# EasyEDA Pro project G3107.eprj

# Schematic Schematic1
Board Name: Board1; Create Date: 2025-10-31; Page Name: P1; Project Name: G3107; Schematic Name: Schematic1; Update Date: 2025-10-31; Company: 嘉立创EDA; Page Size: A4; Version: V1.0
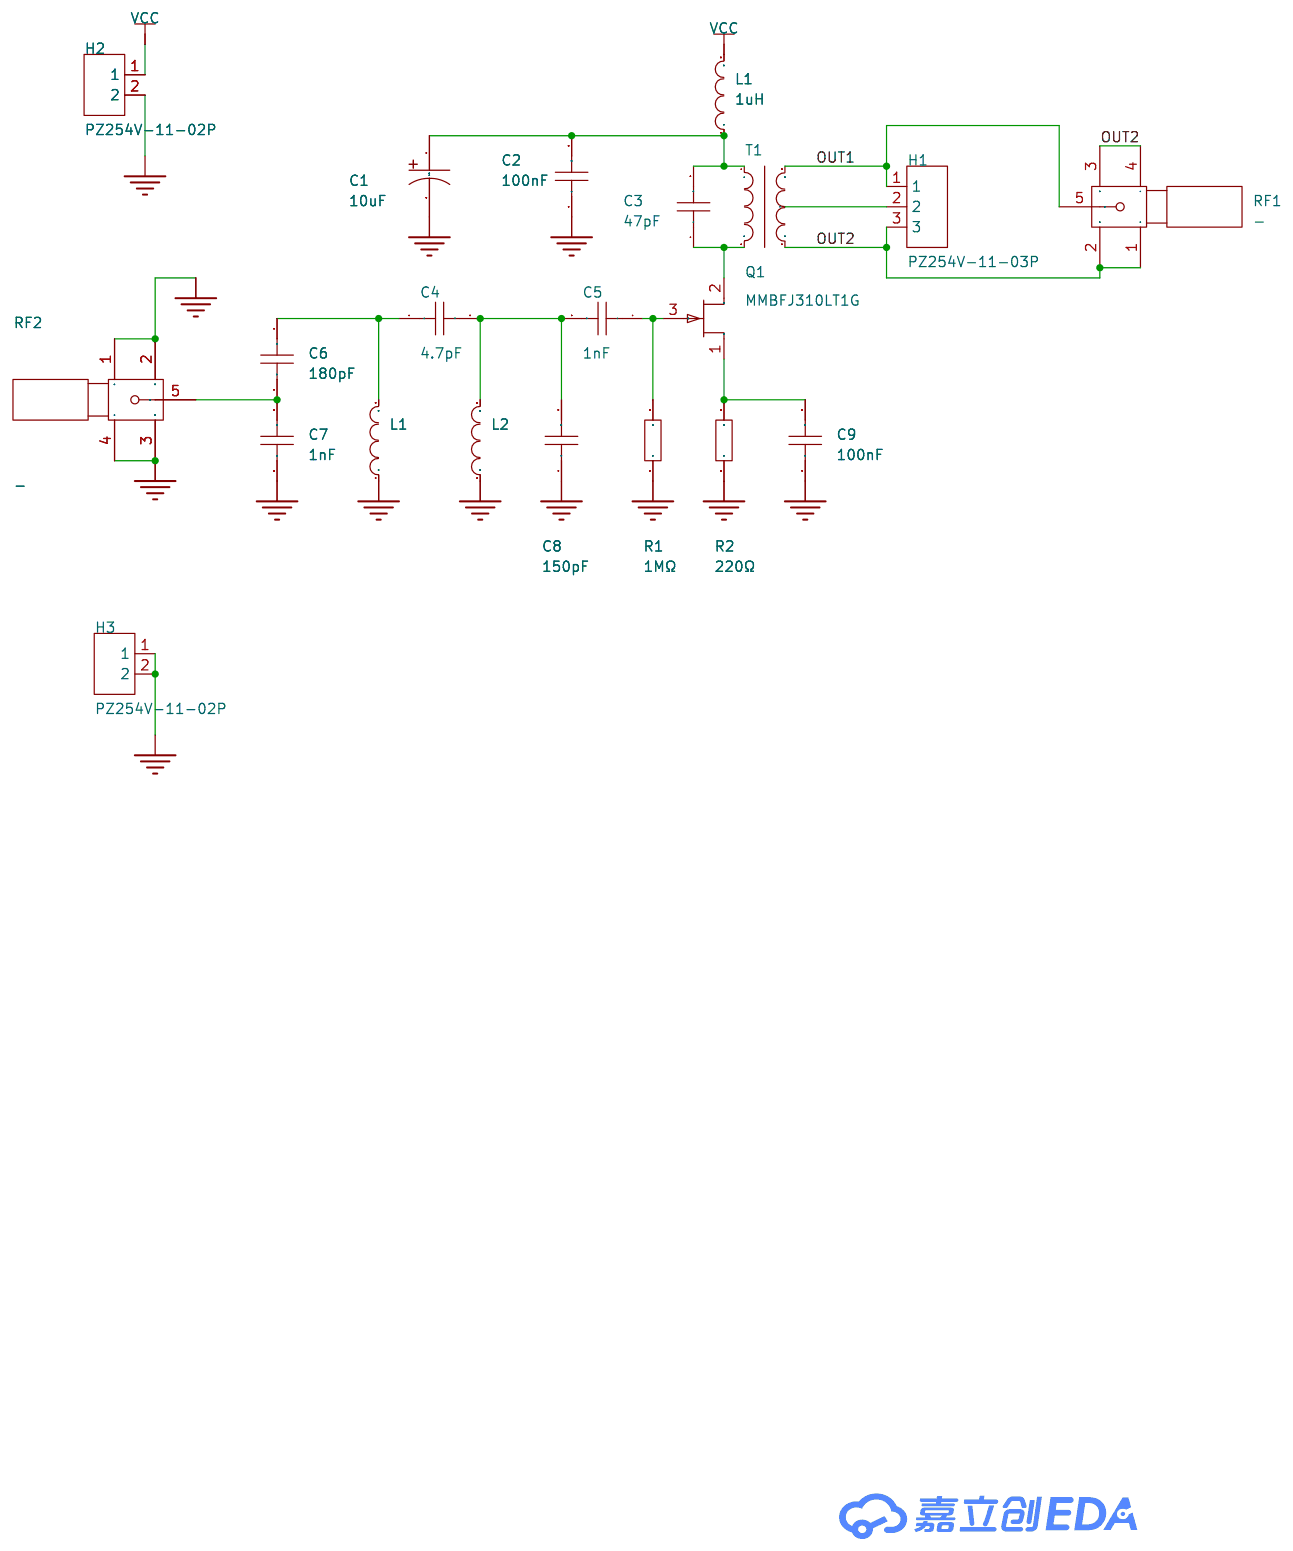
[diagram p0: schematic sheet]

## Parts
C1  10uF  [CAP-SMD_L3.2-W1.6]
C2  100nF  [C0603]
C3  47pF  [C0603]
C4  4.7pF  [C0603]
C5  1nF  [C0603]
C6  180pF  [C0603]
C7  1nF  [C0603]
C8  150pF  [C0603]
C9  100nF  [C0603]
H1  PZ254V-11-03P  [HDR-TH_3P-P2.54-V-M]
H2  PZ254V-11-02P  [HDR-TH_2P-P2.54-V-M]
H3  PZ254V-11-02P  [HDR-TH_2P-P2.54-V-M]
L1  1uH  [IND-SMD_L2.5-W2.0-A]
L1#2  -  [LoT37]
L2  -  [LoT37]
Q1  MMBFJ310LT1G  [SOT-23-3_L2.9-W1.6-P1.90-LS2.8-BR]
R1  1MΩ  [R0603]
R2  220Ω  [R0603]
RF1  -  [SMA-TH_BWSMA-KWE-Z001]
RF2  -  [SMA-TH_BWSMA-KWE-Z001]
T1  -  [ToT37]

## Library data of the parts
C1 = TMCMA0J106MTRF: LCSC Part Name: 10uF ±20% 6.3V; Supplier Part: C215893; Manufacturer: VISHAY(威世); Supplier Footprint: CASE-A-3216; JLCPCB Part Class: 扩展库; Datasheet: https://item.szlcsc.com/datasheet/TMCMA0J106MTRF/216705.html; Supplier: LCSC; Tolerance: ±20%; Voltage Rating: 6.3V; Equivalent Series Resistance(ESR): 2.9Ω@100kHz; Operating Temperature: -55℃~+125℃
C2 C9 = CC0603KRX7R9BB104: LCSC Part Name: 100nF ±10% 50V; Supplier Part: C14663; Manufacturer: YAGEO(国巨); Supplier Footprint: 0603; JLCPCB Part Class: 基础库; Datasheet: https://item.szlcsc.com/datasheet/CC0603KRX7R9BB104/15331.html; Supplier: LCSC; Tolerance: ±10%; Voltage Rating: 50V; Temperature Coefficient: X7R
C3 = CC0603FRNPO9BN470: LCSC Part Name: 47pF ±1% 50V; Supplier Part: C519486; Manufacturer: YAGEO(国巨); Supplier Footprint: 0603; JLCPCB Part Class: 扩展库; Datasheet: https://item.szlcsc.com/datasheet/CC0603FRNPO9BN470/536157.html; Supplier: LCSC; Tolerance: ±1%; Voltage Rating: 50V; Temperature Coefficient: NP0
C4 = CC0603BRNPO9BN4R7: LCSC Part Name: ±0.1pF 4.7pF 50V; Supplier Part: C327022; Manufacturer: YAGEO(国巨); Supplier Footprint: 0603; JLCPCB Part Class: Extended Part; Datasheet: https://item.szlcsc.com/datasheet/CC0603BRNPO9BN4R7/307116.html; Supplier: LCSC; Voltage Rating: 50V; Temperature Coefficient: NP0
C5 C7 = CC0603FRNPO9BN102: LCSC Part Name: 1nF ±1% 50V; Supplier Part: C309468; Manufacturer: YAGEO(国巨); Supplier Footprint: 0603; JLCPCB Part Class: Extended Part; Datasheet: https://item.szlcsc.com/datasheet/CC0603FRNPO9BN102/293084.html; Supplier: LCSC; Tolerance: ±1%; Voltage Rating: 50V; Temperature Coefficient: NP0
C6 = CC0603FRNPO9BN181: LCSC Part Name: 180pF ±1% 50V; Supplier Part: C527047; Manufacturer: YAGEO(国巨); Supplier Footprint: 0603; JLCPCB Part Class: Extended Part; Datasheet: https://item.szlcsc.com/datasheet/CC0603FRNPO9BN181/545473.html; Supplier: LCSC; Tolerance: ±1%; Voltage Rating: 50V; Temperature Coefficient: NP0
C8 = CC0603FRNPO9BN151: LCSC Part Name: 150pF ±1% 50V; Supplier Part: C519499; Manufacturer: YAGEO(国巨); Supplier Footprint: 0603; JLCPCB Part Class: Extended Part; Datasheet: https://item.szlcsc.com/datasheet/CC0603FRNPO9BN151/536170.html; Supplier: LCSC; Tolerance: ±1%; Voltage Rating: 50V; Temperature Coefficient: NP0
H1 = PZ254V-11-03P: LCSC Part Name: 1x3P 间距:2.54mm 方针 直插; Supplier Part: C2937625; Manufacturer: XFCN(兴飞); Supplier Footprint: 插件,P=2.54mm; JLCPCB Part Class: 扩展库; Datasheet: https://item.szlcsc.com/datasheet/PZ254V-11-03P/3293280.html; Supplier: LCSC; Pin Structure: 1x3P; Pitch: 2.54mm; Circluar Pins/Square Pins: 方针; Mounting Type: 直插; Number of Rows: 单排; Number of Pins: 3P; Current Rating: 3A; Voltage Rating (Max): 250V; Length of Mating Pin: 6mm; Insulation Height: 2.5mm; Length of End Connection Pin: 3mm; Operating Temperature: -40℃~+105℃; Color: 黑色
H2 H3 = PZ254V-11-02P: LCSC Part Name: 1x2P 间距:2.54mm 方针 直插; Supplier Part: C492401; Manufacturer: XFCN(兴飞); Supplier Footprint: 插件,P=2.54mm; JLCPCB Part Class: 扩展库; Datasheet: https://item.szlcsc.com/datasheet/PZ254V-11-02P/502957.html; Supplier: LCSC; Pin Structure: 1x2P; Pitch: 2.54mm; Circluar Pins/Square Pins: 方针; Mounting Type: 直插; Number of Rows: 单排; Number of Pins: 2P; Length of Mating Pin: 6mm; Insulation Height: 2.5mm; Length of End Connection Pin: 3mm; Contact Material: 黄铜; Operating Temperature: -40℃~+105℃; Color: 黑色
L1 = MHCD252012A-1R0M-A8SDG: LCSC Part Name: 1uH ±20%; Supplier Part: C2991848; Manufacturer: chilisin(奇力新); Supplier Footprint: 1008; JLCPCB Part Class: 扩展库; Supplier: LCSC; Tolerance: ±20%; Type: 绕线片式电感
L1#2 L2 = LoT37
Q1 = MMBFJ310LT1G: Supplier Part: C33416; Manufacturer: onsemi(安森美); Supplier Footprint: SOT-23; JLCPCB Part Class: 扩展库; Datasheet: https://item.szlcsc.com/datasheet/MMBFJ310LT1G/34381.html; Supplier: LCSC
R1 = 0603WAF1004T5E: LCSC Part Name: 1MΩ ±1% 100mW 厚膜电阻; Supplier Part: C22935; Manufacturer: UNI-ROYAL(厚声); Supplier Footprint: 0603; JLCPCB Part Class: 基础库; Datasheet: https://atta.szlcsc.com/upload/public/pdf/source/20200306/C422600_1E6D84923E4A46A82E41ADD87F860B5C.pdf; Supplier: LCSC; Type: 厚膜电阻; Tolerance: ±1%; Power(Watts): 100mW; Overload Voltage (Max): 75V; Temperature Coefficient: ±100ppm/℃; Operating Temperature Range: -55℃~+155℃
R2 = 0603WAF2200T5E: LCSC Part Name: 220Ω ±1% 100mW 厚膜电阻; Supplier Part: C22962; Manufacturer: UNI-ROYAL(厚声); Supplier Footprint: 0603; JLCPCB Part Class: 基础库; Datasheet: https://atta.szlcsc.com/upload/public/pdf/source/20200306/C422600_1E6D84923E4A46A82E41ADD87F860B5C.pdf; Supplier: LCSC; Type: 厚膜电阻; Tolerance: ±1%; Power(Watts): 100mW; Overload Voltage (Max): 75V; Temperature Coefficient: ±100ppm/℃; Operating Temperature Range: -55℃~+155℃
RF1 RF2 = BWSMA-KWE-Z001: LCSC Part Name: 内孔 SMA 弯头; Supplier Part: C496551; Manufacturer: BAT WIRELESS(蝙蝠无线); Supplier Footprint: 插件; JLCPCB Part Class: 扩展库; Datasheet: https://item.szlcsc.com/datasheet/BWSMA-KWE-Z001/508500.html; Supplier: LCSC; Connector Type: 板端; Interface: 内孔; Number of Ports: 1; Interface Diameter: 5.3mm; RF Series: SMA; Impedance: 50Ω; Style: 弯头
T1 = ToT37

## Nets
GND: C1.2 C2.1 C7.1 C8.1 C9.1 H2.2 H3.1 H3.2 L1#2.1 L2.1 R1.1 R2.1 RF2.1 RF2.2 RF2.3 RF2.4
VCC: H2.1 L1.2
OUT1: H1.1 RF1.5 T1.3
OUT2: H1.3 RF1.1 RF1.2 RF1.3 RF1.4 T1.5
$1N317: C4.2 C5.2 C8.2 L2.2
$1N891: C5.1 Q1.3(G) R1.2
$1N1199: C9.2 Q1.1(D) R2.2
$1N1571: C3.1 Q1.2(S) T1.2
$1N2412: H1.2 T1.4
Net-(C1-1): C1.1 C2.2 C3.2 L1.1 T1.1
Net-(C4-1): C4.1 C6.1 L1#2.2
Net-(C6-2): C6.2 C7.2 RF2.5

# Board PCB1
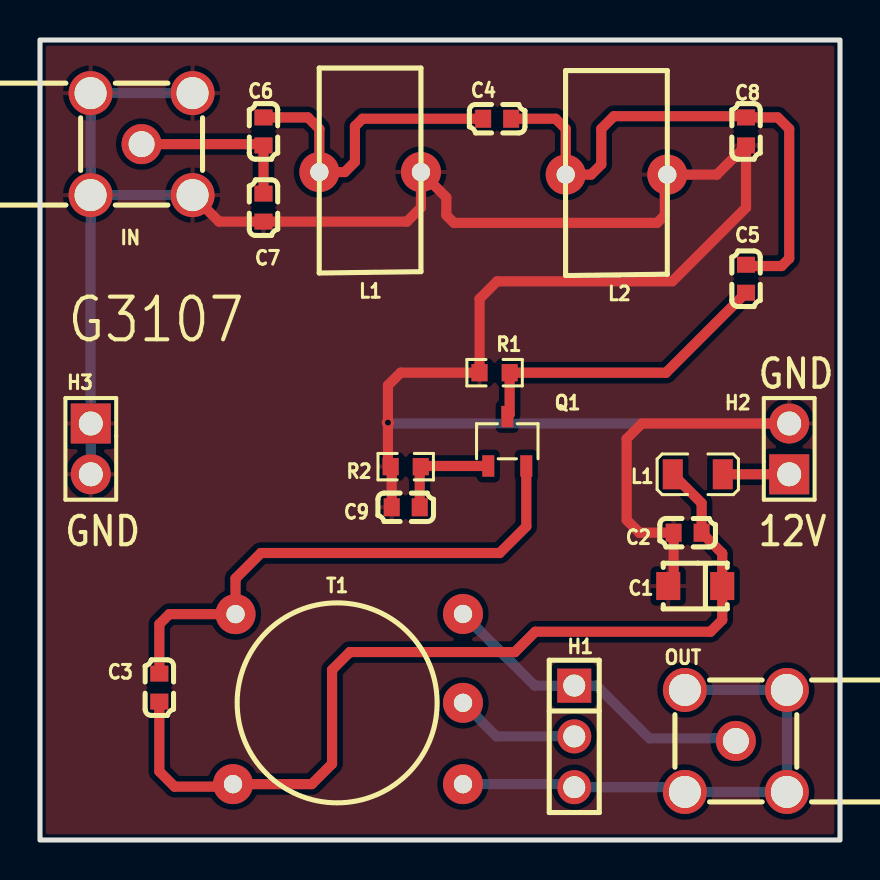
[diagram p1: board, top side]
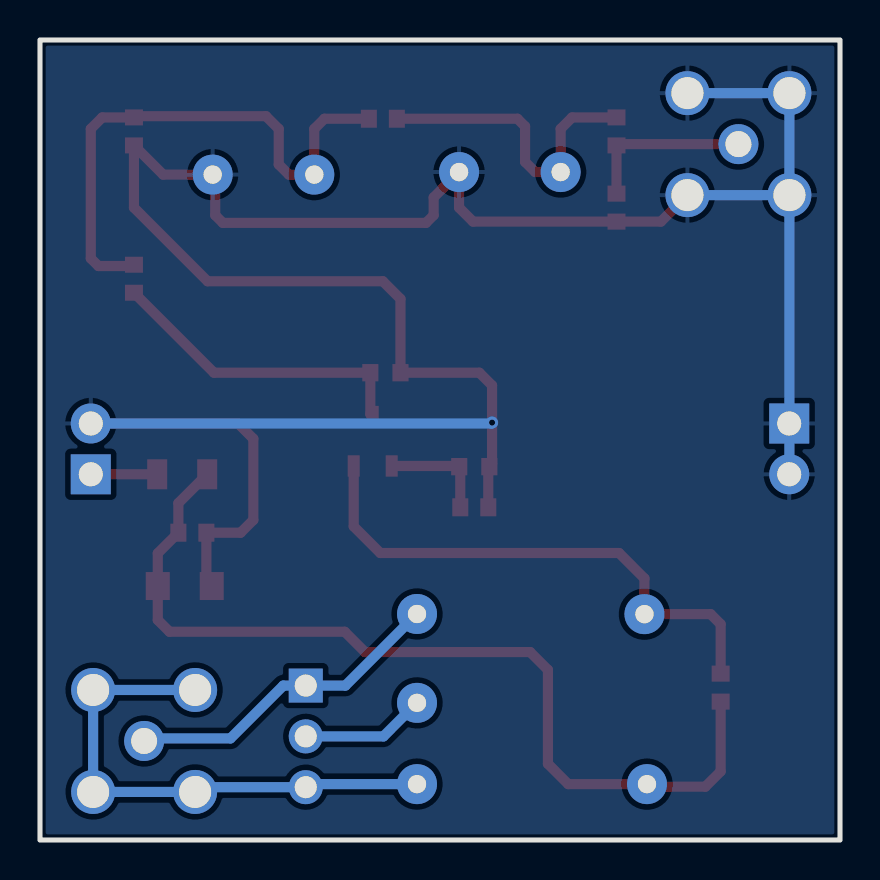
[diagram p2: board, bottom side, seen from below]

Outline 40 x 40 mm; copper layers: Top Layer, Bottom Layer. Coordinates in mm from the lower left corner of the outline.
Outline path: rectangle 0,40 40,0
Stack: Top Layer 0.035mm / Dielectric1 1.51mm FR4 er 4.5 / Bottom Layer 0.035mm

## Design rules (mm)
template: JLCPCB Capability(Two Layers Board)
spacing copperThickness1oz (default): track to track 0.102, other pairs 0.152 to 0.3
spacing copperThickness2oz: track to track 0.203, other pairs 0.152 to 0.3
track width copperThickness1oz (default): min 0.127, default 0.254, max 2.54
track width copperThickness2oz: min 0.203, default 0.254, max 2.54
differential pair differentialPair (default): width min 0.127, default 0.254, max 2.54; gap min 0.152, default 0.152
via viaSize (default): diameter min 0.5, default 0.61, max 10; hole min 0.3, default 0.305, max 6.3

## Placement (name value [footprint] x y rotation side)
C1  10uF  [CAP-SMD_L3.2-W1.6]  32.77 12.7 180 top
C2  100nF  [C0603]  32.38 15.37 0 top
C3  47pF  [C0603]  5.97 7.62 270 top
C4  4.7pF  [C0603]  22.86 36.07 0 top
C5  1nF  [C0603]  35.31 28.07 90 top
C6  180pF  [C0603]  11.18 35.43 270 top
C7  1nF  [C0603]  11.18 31.62 90 top
C8  150pF  [C0603]  35.31 35.43 90 top
C9  100nF  [C0603]  18.29 16.64 0 top
H1  PZ254V-11-03P  [HDR-TH_3P-P2.54-V-M]  26.72 5.18 270 top
H2  PZ254V-11-02P  [HDR-TH_2P-P2.54-V-M]  37.47 19.56 90 top
H3  PZ254V-11-02P  [HDR-TH_2P-P2.54-V-M]  2.54 19.56 270 top
IN  -  [SMA-TH_BWSMA-KWE-Z001]  5.08 34.8 180 top
L1  1uH  [IND-SMD_L2.5-W2.0-A]  32.89 18.29 0 top
L1#2  -  [LoT37]  19.05 33.4 180 top
L2  -  [LoT37]  31.37 33.27 180 top
OUT  -  [SMA-TH_BWSMA-KWE-Z001]  34.8 4.95 0 top
Q1  MMBFJ310LT1G  [SOT-23-3_L2.9-W1.6-P1.90-LS2.8-BR]  23.37 19.94 270 top
R1  1MΩ  [R0603]  22.73 23.37 0 top
R2  220Ω  [R0603]  18.29 18.67 0 top
T1  -  [ToT37]  9.65 2.79 90 top

## Footprints (pads in the part's own frame, mm; a bottom-side part is the same pattern mirrored in y, then rotated)
C0603
  rect 0.8x0.9 smd: 1(-0.7,0) 2(0.7,0)
CAP-SMD_L3.2-W1.6
  rect 1.2x1.4 smd: 1(-1.35,0) 2(1.35,0)
HDR-TH_2P-P2.54-V-M
  rect 2x2 hole 1.2: 1(-1.27,0)
  round 2 hole 1.2: 2(1.27,0)
HDR-TH_3P-P2.54-V-M
  rect 1.7x1.7 hole 1.1: 1(-2.54,0)
  round 1.7 hole 1.1: 2(0,0) 3(2.54,0)
IND-SMD_L2.5-W2.0-A
  rect 1x1.5 smd: 1(-1.25,0) 2(1.25,0)
LoT37
  round 2 hole 0.914: 1(0,0) 2(5.08,0)
R0603
  rect 0.806x0.864 smd: 1(-0.753,0) 2(0.753,0)
SMA-TH_BWSMA-KWE-Z001
  round 2.2 hole 1.6: 1(-2.55,-2.55) 2(-2.55,2.55) 3(2.55,2.55) 4(2.55,-2.55)
  round 2 hole 1.3: 5(0,0)
SOT-23-3_L2.9-W1.6-P1.90-LS2.8-BR
  rect 1.07x0.6 smd: 1(1.235,-0.95) 2(1.235,0.95) 3(-1.235,0)
ToT37
  round 2 hole 0.914: 1(0,0) 2(8.5,-0.127) 3(8.509,-11.5) 4(4.064,-11.5) 5(0,-11.5)

## Nets
GND: C1.2 C2.1 C7.1 C8.1 C9.1 H2.2 H3.1 H3.2 IN.1 IN.2 IN.3 IN.4 L1#2.1 L2.1 R1.1 R2.1
VCC: H2.1 L1.2
OUT1: H1.1 OUT.5 T1.3
OUT2: H1.3 OUT.1 OUT.2 OUT.3 OUT.4 T1.5
$1N316: C4.1 C6.1 L1#2.2
$1N317: C4.2 C5.2 C8.2 L2.2
$1N318: C6.2 C7.2 IN.5
$1N891: C5.1 Q1.3 R1.2
$1N1199: C9.2 Q1.1 R2.2
$1N1562: C1.1 C2.2 C3.2 L1.1 T1.1
$1N1571: C3.1 Q1.2 T1.2
$1N2412: H1.2 T1.4

## Via types
v1: diameter 0.61, hole 0.305, Top Layer to Bottom Layer, 1 via

## Routing (per net, layer and track width the routed paths; a pad name or vN(x,y) marks a point on that pad's centre or on a via; arc(x,y) is an arc through that point)
GND: length 134.9
  Top Layer w0.508: C9.1 17.59,18.62 R2.1 17.4,18.8 v1(17.4,20.87) 17.4,22.73 18.03,23.37 R1.1 21.98,27.06 22.86,27.94 31.62,27.94 35.31,31.62 C8.1 33.85,33.27 L2.1 31.24,33.15 31.24,31.24 30.86,30.86 20.7,30.86 20.32,31.24 20.32,32.13 L1#2.1 19.05,31.62 18.35,30.92 C7.1 8.96,30.92 IN.2 ; H2.2 30.1,20.83 29.34,20.07 29.34,16 29.97,15.37 C2.1 31.69,12.97 C1.2
  Bottom Layer w0.508: IN.3 IN.2 ; IN.3 2.53,18.3 H3.2 ; IN.3 IN.4 IN.1 ; v1(17.4,20.87) 17.44,20.83 H2.2
VCC: length 3.3
  Top Layer w0.508: H2.1 L1.2
OUT1: length 16.3
  Bottom Layer w0.508: OUT.5 34.67,5.08 30.48,5.08 27.84,7.72 H1.1 24.73,7.72 T1.3
OUT2: length 26.6
  Bottom Layer w0.508: T1.5 26.56,2.79 H1.3 32.01,2.64 OUT.1 OUT.4 OUT.3 OUT.2
$1N316: length 15.6
  Top Layer w0.508: 22.22,36.07 16.13,36.07 15.75,35.69 15.75,33.91 15.24,33.4 L1#2.2 13.97,35.56 13.4,36.13 C6.1
$1N317: length 27.7
  Top Layer w0.508: C5.2 35.37,28.7 37.08,28.7 37.47,29.08 37.47,35.56 36.89,36.13 C8.2 ; C4.2 25.78,36.07 26.29,35.56 L2.2 27.56,33.27 28.07,33.78 28.07,35.56 28.7,36.19 35.31,36.19
$1N318: length 8.5
  Top Layer w0.508: IN.5 11.11,34.8 C6.2 11.18,32.32
$1N891: length 15.7
  Top Layer w0.508: C5.1 31.31,23.37 R1.2 23.49,21.29 Q1.3
$1N1199: length 5.4
  Top Layer w0.508: R2.2 19.08,18.7 Q1.1 ; C9.2 18.99,18.62
$1N1562: length 46.5
  Top Layer w0.508: L1.1 33.09,16.85 C2.2 34.12,14.34 C1.1 34.12,11 33.53,10.41 24.76,10.41 23.75,9.4 15.49,9.4 14.6,8.51 14.6,3.81 13.59,2.79 T1.1 9.53,2.67 6.73,2.67 5.97,3.43 C3.2
$1N1571: length 26.9
  Top Layer w0.508: C3.1 5.97,10.79 6.47,11.29 T1.2 9.78,13.08 11.05,14.35 22.99,14.35 24.32,15.68 Q1.2
$1N2412: length 6.3
  Bottom Layer w0.508: H1.2 22.83,5.18 T1.4

## Copper pours and planes (outline as drawn; the poured copper is in the pictures)
GND on Top Layer: 0,40 40,40 40,0 0,0
GND on Bottom Layer: 0,40 40,40 40,0 0,0

## Text on the board
Top Silkscreen Layer: GND | 12V | G3107
